# EAGLE design RW_CAN Ex (EAGLE 9.4.2)
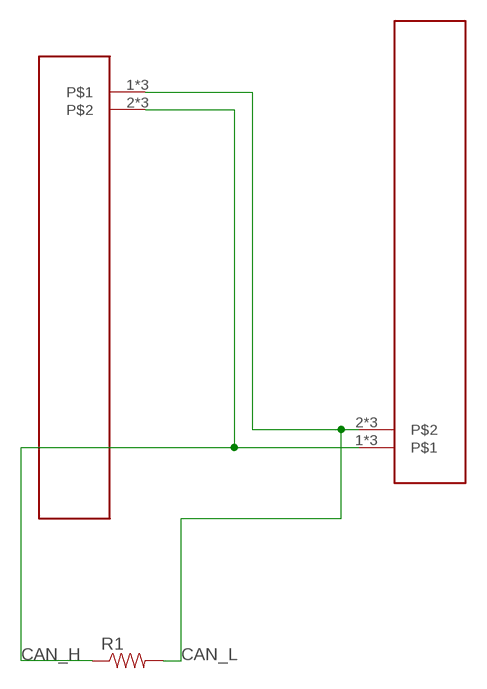
[diagram p0: schematic, sheet 1]

## Parts
R1  RESISTOR1206  [1206]
U$2  WEIDMULLERLSF-3_50-2-90  [LSF_2_90]
U$3  WEIDMULLERLSF-3_50-2-90  [LSF_2_90]

## Nets
CAN_H: R1.1 U$2.2 U$2.12 U$2.22 U$3.1 U$3.11 U$3.21
CAN_L: R1.2 U$2.1 U$2.11 U$2.21 U$3.2 U$3.12 U$3.22

## Library data of the parts
R1 = SparkFun-Passives:RESISTOR: Resistor Basic schematic elements and footprints for 0603, 1206, and PTH resistors.
U$2 U$3 = PhoenixContact:WEIDMULLERLSF-3_50-2-90

## Board
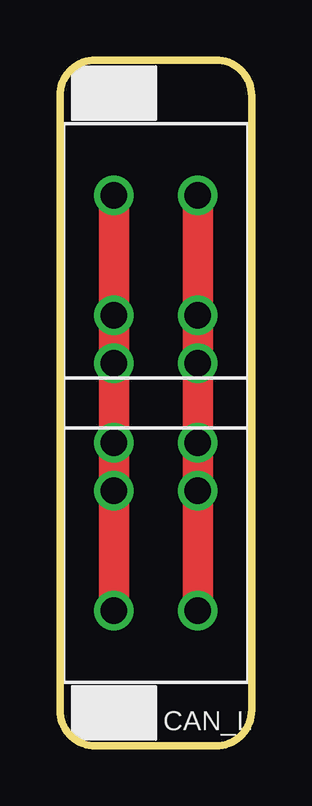
[diagram p1: board, top side]
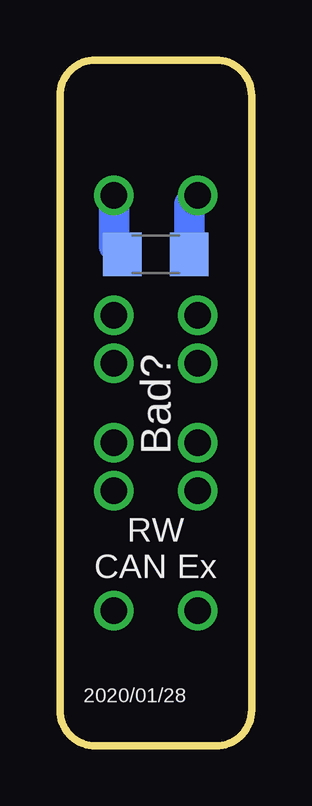
[diagram p2: board, bottom side, seen from below]

Size 8 x 28.6 mm. Coordinates in mm from the lower left corner, seen from the top.
Outline: 1.5,28.6 6.5,28.6 arc-90 8,27.1 8,1.5 arc-90 6.5,0 1.5,0 arc-90 0,1.5 0,27.1 arc-90 1.5,28.6
Copper layers (1*16): Top 0.035mm / dielectric 1.5mm / Bottom 0.035mm
Design rules "SeeedStudio_2layer_DRU_no_angle_20140221": minimum track width 6mil, minimum drill 12mil, track to track 6mil, track to pad 6mil, pad to pad 6mil, via to via 6mil, smd to smd 0mil, copper to edge 10mil, drill to drill 10mil, minimum pad ring 10mil, minimum via ring 6mil, stop-mask expansion 2mil, vias tented up to drill 100mil, thermal gap 10mil

### Footprints (pad centres in the part's own frame; a part is rotated, then mirrored left to right if it is on the bottom)
1206 = smd 1.6 x 1.8: 1 -1.4,0; 2 1.4,0
LSF_2_90 = drill 1.1: 1 1.75,-3.35; 2 -1.75,-3.35; 11 1.75,1.65; 12 -1.75,1.65; 21 1.75,3.65; 22 -1.75,3.65

### Placement (x,y rotation side)
R1  4,20.5 0 bottom
U$2  4,19.6 180 top
U$3  4,9 0 top

### Tracks (layer width: path | path; a pad name or v marks a point on that pad's centre or on a via)
CAN_H
  Top 1.27: U$3.1 U$3.11 U$3.21 U$2.22 U$2.12 U$2.2
  Bottom 1.27: U$2.2 5.75,20.85 R1.1
CAN_L
  Top 1.27: U$3.2 U$3.12 U$3.22 U$2.21 U$2.11 U$2.1
  Bottom 1.27: U$2.1 2.6,22.6 R1.2

### Text on the board
tNames: CAN_L
bNames: Bad? | RW / CAN Ex | 2020/01/28